# Altium schematic sheet RPICM4.SchDoc: Scuba Doo RPi CM4
size B; Organization: CWRUbotix; Address1: 10900 Euclid Avenue; Address2: Cleveland, OH 44106; Address3: USA; SheetNumber: 3; SheetTotal: 5
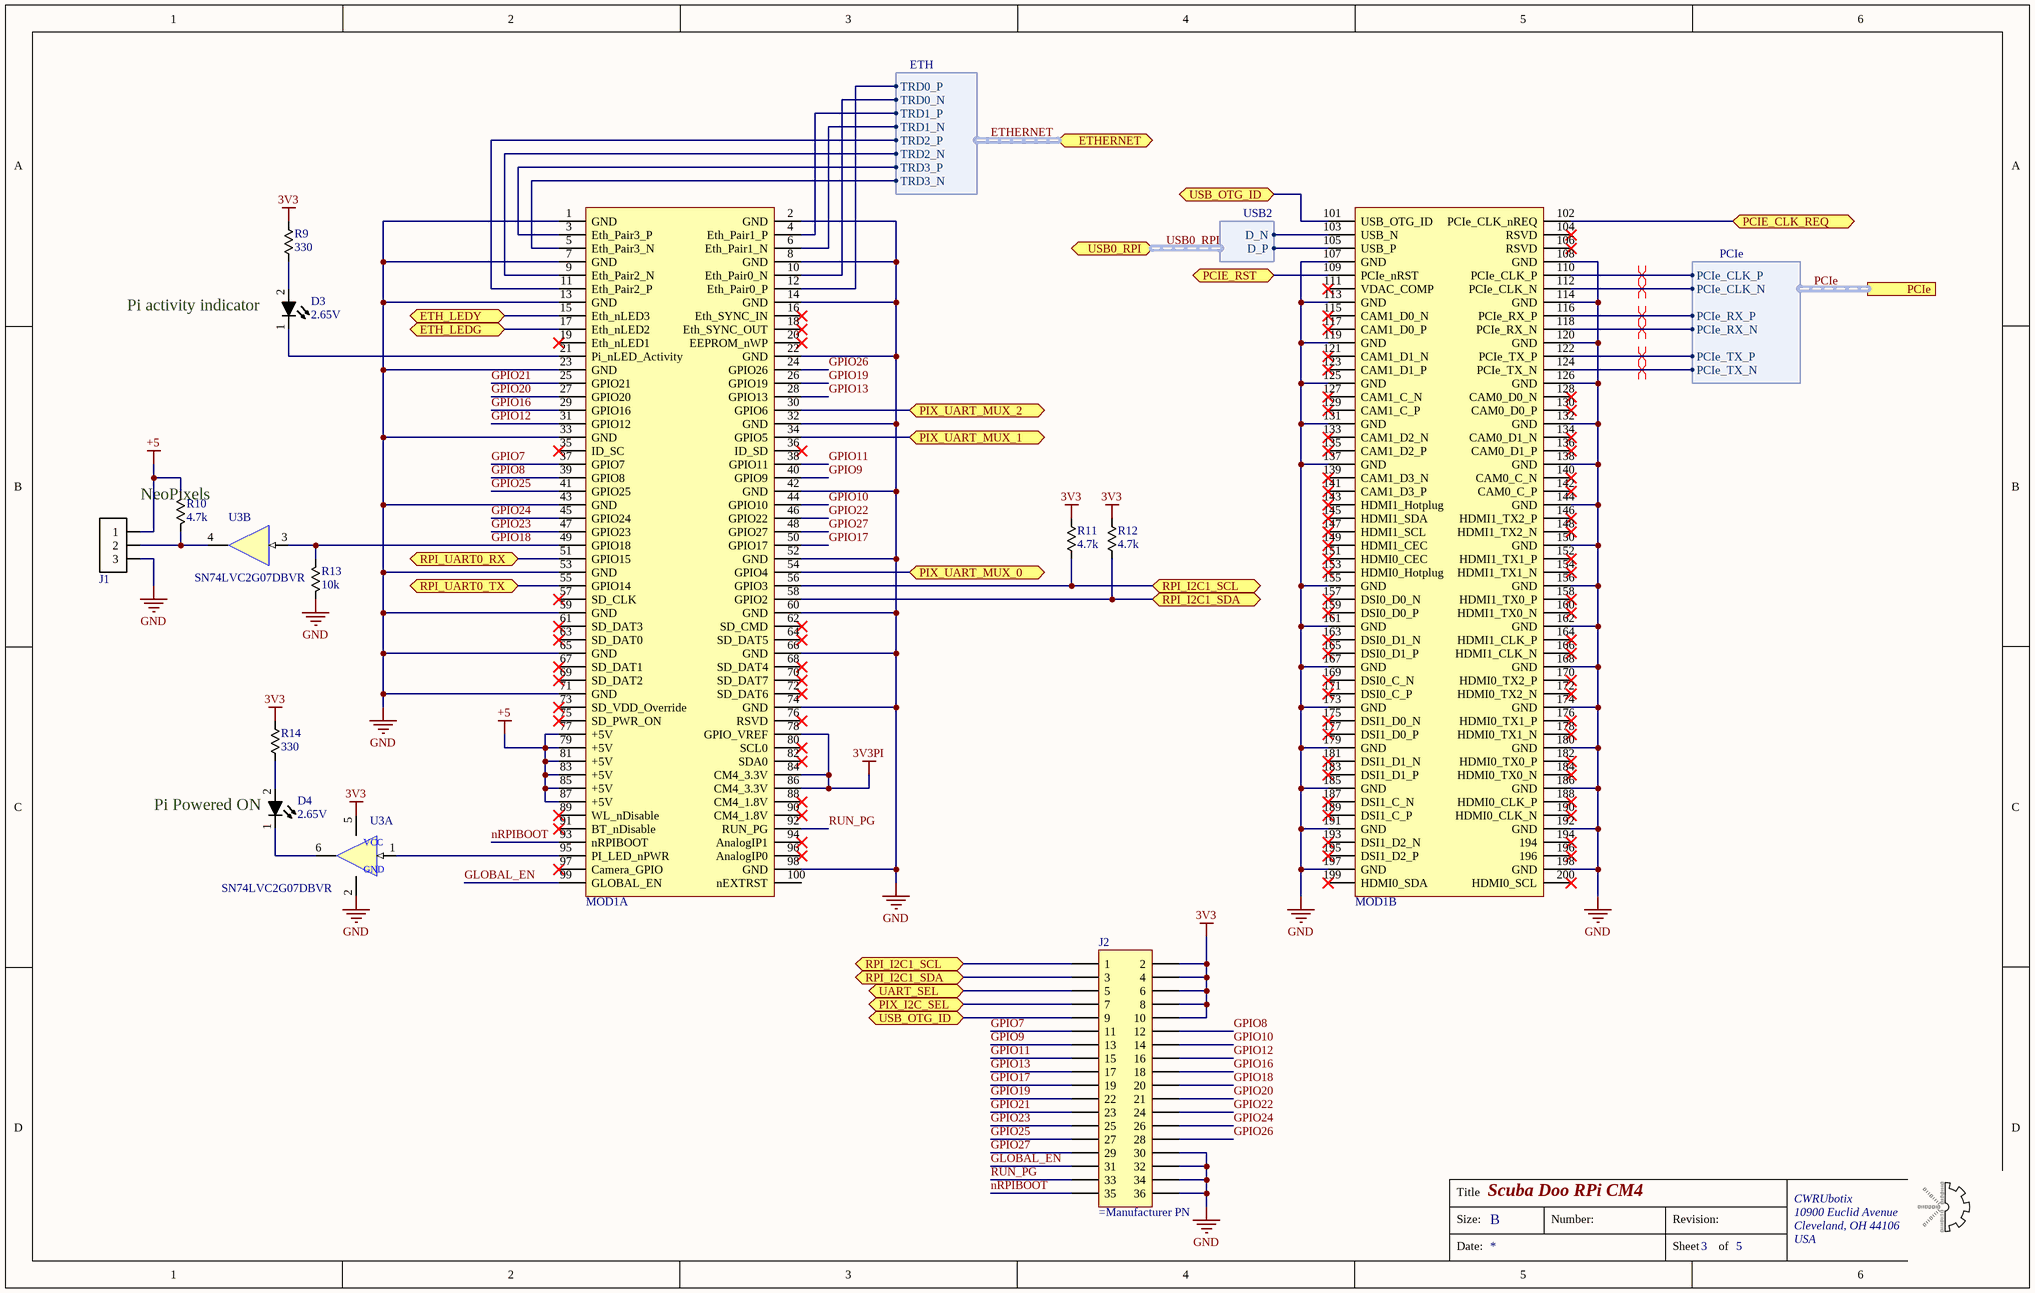
[diagram p0: RPICM4.SchDoc]

## Parts
D3  2.65V  [chip_0603_LED]
D4  2.65V  [chip_0603_LED]
J1  conn-3x1_0  [HDDR_3x1_0]  (value not drawn)
J2  (no value)  [HDDR_18X2_0]
MOD1  CM4004032  [RPI_CM4_3MM]  (value not drawn)  (parts A,B of 2)
R9  330  [chip_0603]
R10  4.7k  [chip_0603]
R11  4.7k  [chip_0603]
R12  4.7k  [chip_0603]
R13  10k  [chip_0603]
R14  330  [chip_0603]
U3  SN74LVC2G07DBVR  [sot-23-6]  (parts A,B of 2)

## Ports
ETH_LEDG (bidir), ETH_LEDY (bidir), ETHERNET (bidir, harness ETH), PCIe (harness PCIe), PCIE_CLK_REQ (bidir), PCIE_RST (bidir), PIX_I2C_SEL (bidir), PIX_UART_MUX_0 (bidir), PIX_UART_MUX_1 (bidir), PIX_UART_MUX_2 (bidir), RPI_I2C1_SCL (bidir), RPI_I2C1_SDA (bidir), RPI_UART0_RX (bidir), RPI_UART0_TX (bidir), UART_SEL (bidir), USB0_RPI (bidir, harness USB2), USB_OTG_ID (bidir)

## Harnesses
PCIe: PCIe_CLK_P, PCIe_CLK_N, PCIe_RX_P, PCIe_RX_N, PCIe_TX_P, PCIe_TX_N
USB2: D_N, D_P
ETH: TRD0_P, TRD0_N, TRD1_N, TRD1_P, TRD2_P, TRD2_N, TRD3_P, TRD3_N

## Nets
3V3: J2.2 J2.4 J2.6 J2.8 J2.10 R9.1 R11.1 R12.1 R14.1 U3.5(VCC)
3V3PI: MOD1.78(GPIO_VREF) MOD1.84(CM4_3.3V) MOD1.86(CM4_3.3V)
+5: J1.1 MOD1.77(+5V) MOD1.79(+5V) MOD1.81(+5V) MOD1.83(+5V) MOD1.85(+5V) MOD1.87(+5V) R10.1
GND: J1.3 J2.30 J2.32 J2.34 J2.36 MOD1.1(GND) MOD1.2(GND) MOD1.7(GND) MOD1.8(GND) MOD1.13(GND) MOD1.14(GND) MOD1.22(GND) MOD1.23(GND) MOD1.32(GND) MOD1.33(GND) MOD1.42(GND) MOD1.43(GND) MOD1.52(GND) MOD1.53(GND) MOD1.59(GND) MOD1.60(GND) MOD1.65(GND) MOD1.66(GND) MOD1.71(GND) MOD1.74(GND) MOD1.98(GND) MOD1.107(GND) MOD1.108(GND) MOD1.113(GND) MOD1.114(GND) MOD1.119(GND) MOD1.120(GND) MOD1.125(GND) MOD1.126(GND) MOD1.131(GND) MOD1.132(GND) MOD1.137(GND) MOD1.138(GND) MOD1.144(GND) MOD1.150(GND) MOD1.155(GND) MOD1.156(GND) MOD1.161(GND) MOD1.162(GND) MOD1.167(GND) MOD1.168(GND) MOD1.173(GND) MOD1.174(GND) MOD1.179(GND) MOD1.180(GND) MOD1.185(GND) MOD1.186(GND) MOD1.191(GND) MOD1.192(GND) MOD1.197(GND) MOD1.198(GND) R13.2 U3.2(GND)
ETH_LEDG: MOD1.17(Eth_nLED2) ; port ETH_LEDG
ETH_LEDY: MOD1.15(Eth_nLED3) ; port ETH_LEDY
ETHERNET.TRD0_N: MOD1.10(Eth_Pair0_N) ; port ETHERNET.TRD0_N
ETHERNET.TRD0_P: MOD1.12(Eth_Pair0_P) ; port ETHERNET.TRD0_P
ETHERNET.TRD1_N: MOD1.6(Eth_Pair1_N) ; port ETHERNET.TRD1_N
ETHERNET.TRD1_P: MOD1.4(Eth_Pair1_P) ; port ETHERNET.TRD1_P
ETHERNET.TRD2_N: MOD1.9(Eth_Pair2_N) ; port ETHERNET.TRD2_N
ETHERNET.TRD2_P: MOD1.11(Eth_Pair2_P) ; port ETHERNET.TRD2_P
ETHERNET.TRD3_N: MOD1.5(Eth_Pair3_N) ; port ETHERNET.TRD3_N
ETHERNET.TRD3_P: MOD1.3(Eth_Pair3_P) ; port ETHERNET.TRD3_P
GLOBAL_EN: J2.31 MOD1.99(GLOBAL_EN)
GPIO7: J2.11 MOD1.37(GPIO7)
GPIO8: J2.12 MOD1.39(GPIO8)
GPIO9: J2.13 MOD1.40(GPIO9)
GPIO10: J2.14 MOD1.44(GPIO10)
GPIO11: J2.15 MOD1.38(GPIO11)
GPIO12: J2.16 MOD1.31(GPIO12)
GPIO13: J2.17 MOD1.28(GPIO13)
GPIO16: J2.18 MOD1.29(GPIO16)
GPIO17: J2.19 MOD1.50(GPIO17)
GPIO18: J2.20 MOD1.49(GPIO18) R13.1 U3.3(2A)
GPIO19: J2.22 MOD1.26(GPIO19)
GPIO20: J2.21 MOD1.27(GPIO20)
GPIO21: J2.23 MOD1.25(GPIO21)
GPIO22: J2.24 MOD1.46(GPIO22)
GPIO23: J2.25 MOD1.47(GPIO23)
GPIO24: J2.26 MOD1.45(GPIO24)
GPIO25: J2.27 MOD1.41(GPIO25)
GPIO26: J2.28 MOD1.24(GPIO26)
GPIO27: J2.29 MOD1.48(GPIO27)
nRPIBOOT: J2.35 MOD1.93(nRPIBOOT)
PCIe.PCIe_CLK_N: MOD1.112(PCIe_CLK_N) ; port PCIe.PCIe_CLK_N
PCIe.PCIe_CLK_P: MOD1.110(PCIe_CLK_P) ; port PCIe.PCIe_CLK_P
PCIe.PCIe_RX_N: MOD1.118(PCIe_RX_N) ; port PCIe.PCIe_RX_N
PCIe.PCIe_RX_P: MOD1.116(PCIe_RX_P) ; port PCIe.PCIe_RX_P
PCIe.PCIe_TX_N: MOD1.124(PCIe_TX_N) ; port PCIe.PCIe_TX_N
PCIe.PCIe_TX_P: MOD1.122(PCIe_TX_P) ; port PCIe.PCIe_TX_P
PCIE_CLK_REQ: MOD1.102(PCIe_CLK_nREQ) ; port PCIE_CLK_REQ
PCIE_RST: MOD1.109(PCIe_nRST) ; port PCIE_RST
PIX_I2C_SEL: J2.7 ; port PIX_I2C_SEL
PIX_UART_MUX_0: MOD1.54(GPIO4) ; port PIX_UART_MUX_0
PIX_UART_MUX_1: MOD1.34(GPIO5) ; port PIX_UART_MUX_1
PIX_UART_MUX_2: MOD1.30(GPIO6) ; port PIX_UART_MUX_2
RPI_I2C1_SCL: J2.1 MOD1.56(GPIO3) R11.2 ; port RPI_I2C1_SCL
RPI_I2C1_SDA: J2.3 MOD1.58(GPIO2) R12.2 ; port RPI_I2C1_SDA
RPI_UART0_RX: MOD1.51(GPIO15) ; port RPI_UART0_RX
RPI_UART0_TX: MOD1.55(GPIO14) ; port RPI_UART0_TX
RUN_PG: J2.33 MOD1.92(RUN_PG)
UART_SEL: J2.5 ; port UART_SEL
USB0_RPI.D_N: MOD1.103(USB_N) ; port USB0_RPI.D_N
USB0_RPI.D_P: MOD1.105(USB_P) ; port USB0_RPI.D_P
USB_OTG_ID: J2.9 MOD1.101(USB_OTG_ID) ; port USB_OTG_ID
NetD3_1: D3.1 MOD1.21(Pi_nLED_Activity)
NetD3_2: D3.2 R9.2
NetD4_1: D4.1 U3.6(1Y)
NetD4_2: D4.2 R14.2
NetJ1_2: J1.2 R10.2 U3.4(2Y)
NetMOD1_95: MOD1.95(PI_LED_nPWR) U3.1(1A)

Not connected (* = marked no-connect by the designer): MOD1 16(Eth_SYNC_IN)* 18(Eth_SYNC_OUT)* 19(Eth_nLED1)* 20(EEPROM_nWP)* 35(ID_SC)* 36(ID_SD)* 57(SD_CLK)* 61(SD_DAT3)* 62(SD_CMD)* 63(SD_DAT0)* 64(SD_DAT5)* 67(SD_DAT1)* 68(SD_DAT4)* 69(SD_DAT2)* 70(SD_DAT7)* 72(SD_DAT6)* 73(SD_VDD_Override)* 75(SD_PWR_ON)* 76(RSVD)* 80(SCL0)* 82(SDA0)* 88(CM4_1.8V)* 89(WL_nDisable)* 90(CM4_1.8V)* 91(BT_nDisable)* 94(AnalogIP1)* 96(AnalogIP0)* 97(Camera_GPIO)* 100(nEXTRST) 104(RSVD)* 106(RSVD)* 111(VDAC_COMP)* 115(CAM1_D0_N)* 117(CAM1_D0_P)* 121(CAM1_D1_N)* 123(CAM1_D1_P)* 127(CAM1_C_N)* 128(CAM0_D0_N)* 129(CAM1_C_P)* 130(CAM0_D0_P)* 133(CAM1_D2_N)* 134(CAM0_D1_N)* 135(CAM1_D2_P)* 136(CAM0_D1_P)* 139(CAM1_D3_N)* 140(CAM0_C_N)* 141(CAM1_D3_P)* 142(CAM0_C_P)* 143(HDMI1_Hotplug)* 145(HDMI1_SDA)* 146(HDMI1_TX2_P)* 147(HDMI1_SCL)* 148(HDMI1_TX2_N)* 149(HDMI1_CEC)* 151(HDMI0_CEC)* 152(HDMI1_TX1_P)* 153(HDMI0_Hotplug)* 154(HDMI1_TX1_N)* 157(DSI0_D0_N)* 158(HDMI1_TX0_P)* 159(DSI0_D0_P)* 160(HDMI1_TX0_N)* 163(DSI0_D1_N)* 164(HDMI1_CLK_P)* 165(DSI0_D1_P)* 166(HDMI1_CLK_N)* 169(DSI0_C_N)* 170(HDMI0_TX2_P)* 171(DSI0_C_P)* 172(HDMI0_TX2_N)* 175(DSI1_D0_N)* 176(HDMI0_TX1_P)* 177(DSI1_D0_P)* 178(HDMI0_TX1_N)* 181(DSI1_D1_N)* 182(HDMI0_TX0_P)* 183(DSI1_D1_P)* 184(HDMI0_TX0_N)* 187(DSI1_C_N)* 188(HDMI0_CLK_P)* 189(DSI1_C_P)* 190(HDMI0_CLK_N)* 193(DSI1_D2_N)* 194* 195(DSI1_D2_P)* 196* 199(HDMI0_SDA)* 200(HDMI0_SCL)*

## Buses and harness runs
harness ETHERNET = port ETHERNET
harness PCIe = port PCIe
harness USB0_RPI = port USB0_RPI

## Layout directives
differential pair; differential pair class PCIe: PCIe.PCIe_CLK_N, PCIe.PCIe_CLK_P, PCIe.PCIe_RX_N, PCIe.PCIe_RX_P, PCIe.PCIe_TX_N, PCIe.PCIe_TX_P

## Notes on the sheet
- (near D3) Pi activity indicator
- NeoPixels
- (near D4) Pi Powered ON
- Title
- Size:
- B
- Number:
- Revision:
- Date:
- Sheet
- of

## Library data of the parts
D3 D4 = DIO-00050: LED, Green, 0603, Low current, HELI2 Series; Manufacturer: Kingbright; Manufacturer PN: APT1608LZGCK; Reverse Breakdown Voltage: 5V; Power Rating: 120mW; Current Rating: 30mA; Part Number: DIO-00050; Forward Voltage: 2.65V; Type: LED; Cost: 0.58
J1 = CONN-00037: Header, 3x1, 0.1"; Positions per level: 3; Levels: 1; Part Number: CONN-00037; Type: Header
J2 = CONN-00005: Header 18x2, 0.1"; Positions per level: 18; Levels: 2; Part Number: CONN-00005
MOD1 = MISC-00060: Raspberry Pi 4 Compute Module, CM4, 4GB DDR4, 32 GB eMMC; Manufacturer: Raspberry Pi Foundation; Part Number: MISC-00060; Manufacturer PN: CM4004032; Cost: 60
R9 R14 = RES-00221: RES SMD 330 OHM 1% 1/4W 0603; Manufacturer: Panasonic; Manufacturer PN: ERJ-PA3F3300V; Power Rating: 0.25W; Part Number: RES-00221; Resistance: 330; Tolerance: 1%
R10-R12 = RES-00470: RES SMD 4.7K OHM 1% 1/4W 0603; Manufacturer: Panasonic; Manufacturer PN: ERJ-PA3F4701V; Power Rating: 0.25W; Part Number: RES-00470; Resistance: 4.7k; Tolerance: 1%
R13 = RES-00306: RES SMD 10K OHM 1% 1/4W 0603; Manufacturer: Panasonic; Manufacturer PN: ERJ-PA3F1002V; Power Rating: 0.25W; Part Number: RES-00306; Resistance: 10k; Tolerance: 1%; Cost: 0.144
U3 = LOGIC-00046: IC, Buffer Non-Inverting, Dual, Open-Drain Outputs, 1.65~5.5V, SOT-23-6; Manufacturer: TI; Part Number: LOGIC-00046; Manufacturer PN: SN74LVC2G07DBVR; Cost: $0.43